# Altium schematic sheet Power.SchDoc
size A4
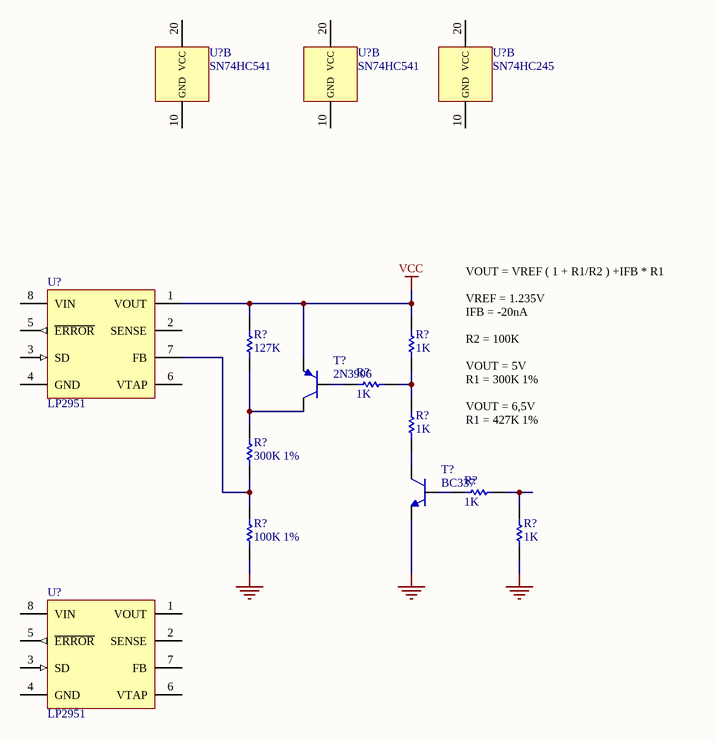
[diagram p0: Power.SchDoc]

## Parts
(Parts that share a designator on the sheet are numbered #1, #2 ... from top to bottom, then left to right.)
R?#1  127K  [0805]
R?#2  1K  [0805]
R?#3  1K  [0805]
R?#4  1K  [0805]
R?#5  300K 1%  [0805]
R?#6  1K  [0805]
R?#7  100K 1%  [0805]
R?#8  1K  [0805]
T?#1  2N3906  [TO-92 STRAIGHT]
T?#2  BC337  [TO-92 STRAIGHT]
U?#1  SN74HC541  [SOIC20]  (part B of 2)
U?#2  SN74HC541  [SOIC20]  (part B of 2)
U?#3  SN74HC245  [SOIC20]  (part B of 2)
U?#4  LP2951  [SOIC8]
U?#5  LP2951  [SOIC8]

## Nets
GND: R?#7.2 R?#8.2 T?#2.3(E)
VCC: R?#1.1 R?#2.1 T?#1.1(E) U?#4.1(VOUT)
NetR?#1_2: R?#1.2 R?#5.1 T?#1.3(C)
NetR?#2_2: R?#2.2 R?#3.2 R?#4.1
NetR?#3_1: R?#3.1 T?#1.2(B)
NetR?#4_2: R?#4.2 T?#2.1(C)
NetR?#5_2: R?#5.2 R?#7.1 U?#4.7(FB)
NetR?#6_1: R?#6.1 T?#2.2(B)
NetR?#6_2: R?#6.2 R?#8.1

Not connected (* = marked no-connect by the designer): U?#1 10(GND) 20(VCC); U?#2 10(GND) 20(VCC); U?#3 10(GND) 20(VCC); U?#4 2(SENSE) 3(SD) 4(GND) 5(~{ERROR}) 6(VTAP) 8(VIN); U?#5 1(VOUT) 2(SENSE) 3(SD) 4(GND) 5(~{ERROR}) 6(VTAP) 7(FB) 8(VIN)

## Notes on the sheet
- VOUT = VREF ( 1 + R1/R2 ) +IFB * R1
  VREF = 1.235V
  IFB = -20nA
  R2 = 100K
  VOUT = 5V
  R1 = 300K 1%
  VOUT = 6,5V
  R1 = 427K 1%

## Library data of the parts
R?#1-R?#8 = Resistor
T?#1 = 2N3906: PNP Silicon General Purpose Transistors
T?#2 = BC337: NPN Silicon Amplifier Transistors
U?#1 U?#2 = SN74HC541 Type-2: Octal Buffers and Line Drivers With 3-State Outputs
U?#3 = SN74HC245 Type-2: Octal Bus Transceivers with 3-State Outputs
U?#4 U?#5 = LP2951 Type 2: Micropower Voltage Regulators with Shutdown